# EAGLE design lighting_ctl_ft245_8 (EAGLE 5.01)
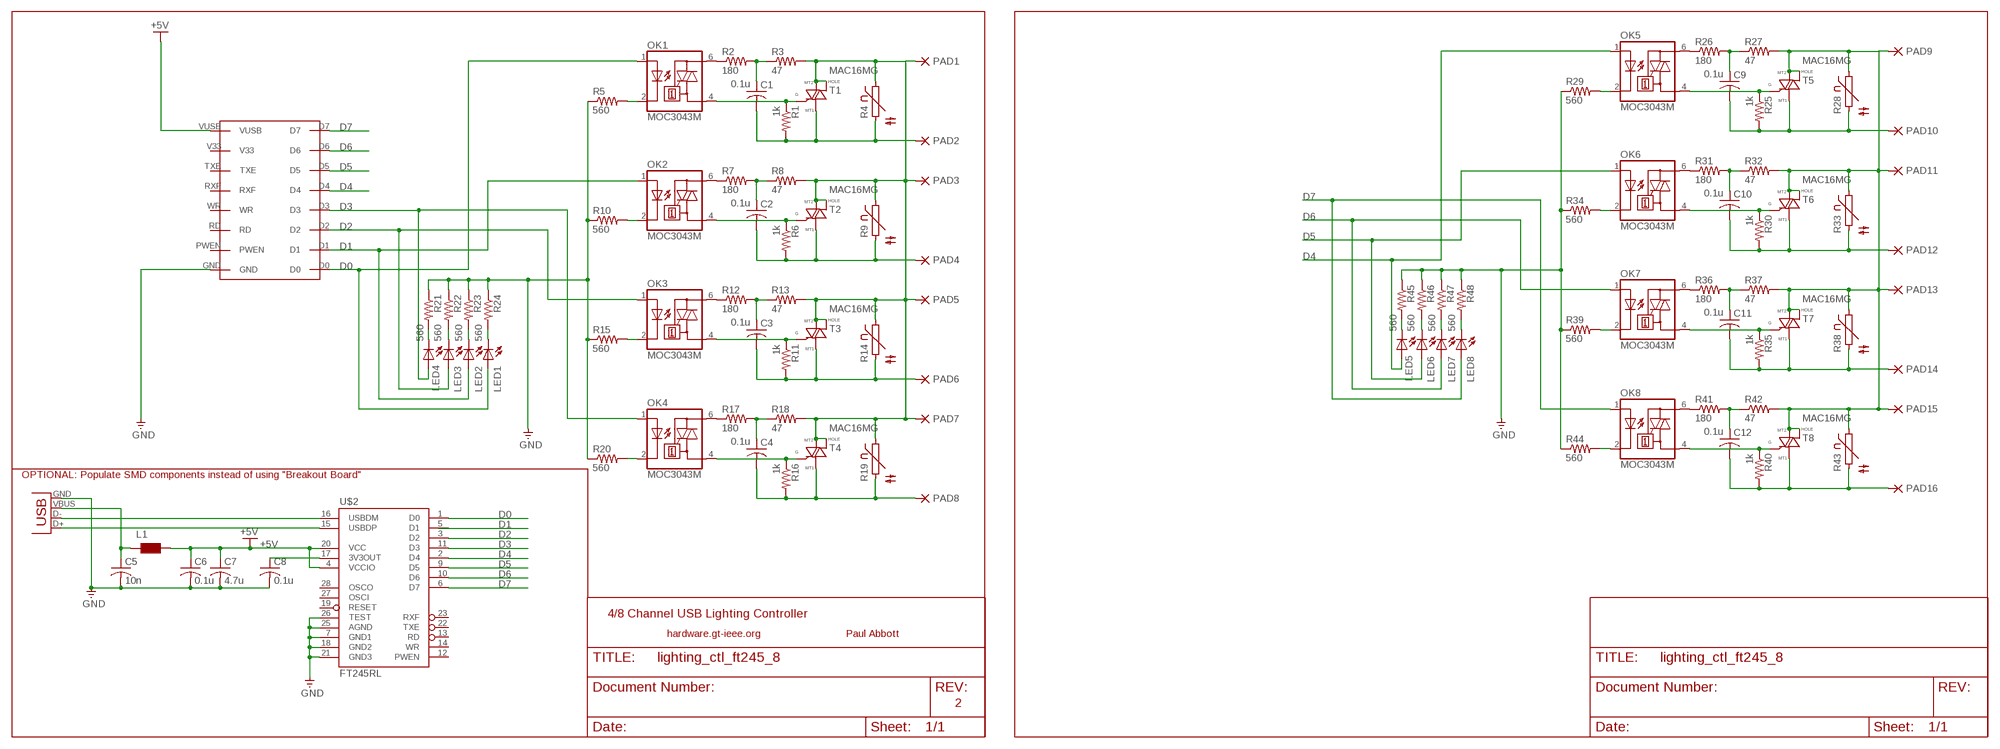
[diagram p0: schematic, sheet 1]

## Parts
C1  0.1u  C-US075-032X103  [C075-032X103]
C2  0.1u  C-US075-032X103  [C075-032X103]
C3  0.1u  C-US075-032X103  [C075-032X103]
C4  0.1u  C-US075-032X103  [C075-032X103]
C5  10n  C-USC0603  [C0603]
C6  0.1u  C-USC0603  [C0603]
C7  4.7u  C-USC1206  [C1206]
C8  0.1u  C-USC0603  [C0603]
C9  0.1u  C-US075-032X103  [C075-032X103]
C10  0.1u  C-US075-032X103  [C075-032X103]
C11  0.1u  C-US075-032X103  [C075-032X103]
C12  0.1u  C-US075-032X103  [C075-032X103]
L1  WE-CBF_0805  [0805]
LED1  LED3MM  [LED3MM]
LED2  LED3MM  [LED3MM]
LED3  LED3MM  [LED3MM]
LED4  LED3MM  [LED3MM]
LED5  LED3MM  [LED3MM]
LED6  LED3MM  [LED3MM]
LED7  LED3MM  [LED3MM]
LED8  LED3MM  [LED3MM]
OK1  MOC3043M  MOC3010M  [DIL06]
OK2  MOC3043M  MOC3010M  [DIL06]
OK3  MOC3043M  MOC3010M  [DIL06]
OK4  MOC3043M  MOC3010M  [DIL06]
OK5  MOC3043M  MOC3010M  [DIL06]
OK6  MOC3043M  MOC3010M  [DIL06]
OK7  MOC3043M  MOC3010M  [DIL06]
OK8  MOC3043M  MOC3010M  [DIL06]
PAD1  PAD-0820  [0820]
PAD2  PAD-0820  [0820]
PAD3  PAD-0820  [0820]
PAD4  PAD-0820  [0820]
PAD5  PAD-0820  [0820]
PAD6  PAD-0820  [0820]
PAD7  PAD-0820  [0820]
PAD8  PAD-0820  [0820]
PAD9  PAD-0820  [0820]
PAD10  PAD-0820  [0820]
PAD11  PAD-0820  [0820]
PAD12  PAD-0820  [0820]
PAD13  PAD-0820  [0820]
PAD14  PAD-0820  [0820]
PAD15  PAD-0820  [0820]
PAD16  PAD-0820  [0820]
R1  1k  R-US_0613/5V  [P0613V]
R2  180  R-US_0613/5V  [P0613V]
R3  47  R-US_0613/5V  [P0613V]
R4  P595  [P595]
R5  560  R-US_0613/5V  [P0613V]
R6  1k  R-US_0613/5V  [P0613V]
R7  180  R-US_0613/5V  [P0613V]
R8  47  R-US_0613/5V  [P0613V]
R9  P595  [P595]
R10  560  R-US_0613/5V  [P0613V]
R11  1k  R-US_0613/5V  [P0613V]
R12  180  R-US_0613/5V  [P0613V]
R13  47  R-US_0613/5V  [P0613V]
R14  P595  [P595]
R15  560  R-US_0613/5V  [P0613V]
R16  1k  R-US_0613/5V  [P0613V]
R17  180  R-US_0613/5V  [P0613V]
R18  47  R-US_0613/5V  [P0613V]
R19  P595  [P595]
R20  560  R-US_0613/5V  [P0613V]
R21  560  R-US_0613/5V  [P0613V]
R22  560  R-US_0613/5V  [P0613V]
R23  560  R-US_0613/5V  [P0613V]
R24  560  R-US_0613/5V  [P0613V]
R25  1k  R-US_0613/5V  [P0613V]
R26  180  R-US_0613/5V  [P0613V]
R27  47  R-US_0613/5V  [P0613V]
R28  P595  [P595]
R29  560  R-US_0613/5V  [P0613V]
R30  1k  R-US_0613/5V  [P0613V]
R31  180  R-US_0613/5V  [P0613V]
R32  47  R-US_0613/5V  [P0613V]
R33  P595  [P595]
R34  560  R-US_0613/5V  [P0613V]
R35  1k  R-US_0613/5V  [P0613V]
R36  180  R-US_0613/5V  [P0613V]
R37  47  R-US_0613/5V  [P0613V]
R38  P595  [P595]
R39  560  R-US_0613/5V  [P0613V]
R40  1k  R-US_0613/5V  [P0613V]
R41  180  R-US_0613/5V  [P0613V]
R42  47  R-US_0613/5V  [P0613V]
R43  P595  [P595]
R44  560  R-US_0613/5V  [P0613V]
R45  560  R-US_0613/5V  [P0613V]
R46  560  R-US_0613/5V  [P0613V]
R47  560  R-US_0613/5V  [P0613V]
R48  560  R-US_0613/5V  [P0613V]
T1  MAC16MG  BT138  [TO220BH]
T2  MAC16MG  BT138  [TO220BH]
T3  MAC16MG  BT138  [TO220BH]
T4  MAC16MG  BT138  [TO220BH]
T5  MAC16MG  BT138  [TO220BH]
T6  MAC16MG  BT138  [TO220BH]
T7  MAC16MG  BT138  [TO220BH]
T8  MAC16MG  BT138  [TO220BH]
U$1  FT245BREAKOUT  [FT245BREAKOUT]
U$2  FT245RL  [SSOP28DB]
X1  USBSMD  [USB-MINIB]

## Nets
+5V [5V]: C6.1 C7.1 L1.2 U$1.VUSB U$2.4(VCCIO) U$2.20(VCC)
D0 [data]: LED1.A OK1.1(A) U$1.D0 U$2.1(D0)
D1 [data]: LED2.A OK2.1(A) U$1.D1 U$2.5(D1)
D2 [data]: LED3.A OK3.1(A) U$1.D2 U$2.3(D2)
D3 [data]: LED4.A OK4.1(A) U$1.D3 U$2.11(D3)
D4 [data]: LED5.A OK5.1(A) U$1.D4 U$2.2(D4)
D5 [data]: LED6.A OK6.1(A) U$1.D5 U$2.9(D5)
D6 [data]: LED7.A OK7.1(A) U$1.D6 U$2.10(D6)
D7 [data]: LED8.A OK8.1(A) U$1.D7 U$2.6(D7)
GND [5V]: C5.2 C6.2 C7.2 C8.2 R5.1 R10.1 R15.1 R20.1 R21.1 R22.1 R23.1 R24.1 R29.1 R34.1 R39.1 R44.1 R45.1 R46.1 R47.1 R48.1 U$1.GND U$2.7(GND1) U$2.18(GND2) U$2.21(GND3) U$2.25(AGND) U$2.26(TEST) X1.GND
L1_COMM [power]: PAD1.P$1(P) PAD3.P$1(P) PAD5.P$1(P) PAD7.P$1(P) R3.2 R4.1 R8.2 R9.1 R13.2 R14.1 R18.2 R19.1 T1.HOLE T1.T2(A2) T2.HOLE T2.T2(A2) T3.HOLE T3.T2(A2) T4.HOLE T4.T2(A2)
L2_COMM [power]: PAD9.P$1(P) PAD11.P$1(P) PAD13.P$1(P) PAD15.P$1(P) R27.2 R28.1 R32.2 R33.1 R37.2 R38.1 R42.2 R43.1 T5.HOLE T5.T2(A2) T6.HOLE T6.T2(A2) T7.HOLE T7.T2(A2) T8.HOLE T8.T2(A2)
N$1 [power]: C1.2 PAD2.P$1(P) R1.2 R4.2 T1.T1(A1)
N$2: OK1.4(A1) R1.1 T1.G
N$3: OK1.6(A2) R2.1
N$4 [power]: C2.2 PAD4.P$1(P) R6.2 R9.2 T2.T1(A1)
N$5 [data]: U$2.15(USBDP) X1.D+
N$6: C1.1 R2.2 R3.1
N$7 [data]: U$2.16(USBDM) X1.D-
N$8: OK1.2(C) R5.2
N$9: OK2.4(A1) R6.1 T2.G
N$10: OK2.6(A2) R7.1
N$11: LED1.K(C) R24.2
N$12: C2.1 R7.2 R8.1
N$13: OK2.2(C) R10.2
N$14: LED2.K(C) R23.2
N$15 [power]: C3.2 PAD6.P$1(P) R11.2 R14.2 T3.T1(A1)
N$16: OK3.4(A1) R11.1 T3.G
N$17: OK3.6(A2) R12.1
N$18: C8.1 U$2.17(3V3OUT)
N$19: C3.1 R12.2 R13.1
N$20: OK3.2(C) R15.2
N$21 [power]: C4.2 PAD8.P$1(P) R16.2 R19.2 T4.T1(A1)
N$22: OK4.4(A1) R16.1 T4.G
N$23: OK4.6(A2) R17.1
N$24: LED3.K(C) R22.2
N$25: C4.1 R17.2 R18.1
N$26: OK4.2(C) R20.2
N$27: LED4.K(C) R21.2
N$28 [5V]: C5.1 L1.1 X1.VBUS
N$29 [power]: C9.2 PAD10.P$1(P) R25.2 R28.2 T5.T1(A1)
N$30: OK5.4(A1) R25.1 T5.G
N$31: OK5.6(A2) R26.1
N$32: C9.1 R26.2 R27.1
N$33 [power]: C10.2 PAD12.P$1(P) R30.2 R33.2 T6.T1(A1)
N$34: OK6.4(A1) R30.1 T6.G
N$35: OK6.6(A2) R31.1
N$36: C10.1 R31.2 R32.1
N$37 [power]: C11.2 PAD14.P$1(P) R35.2 R38.2 T7.T1(A1)
N$38: OK7.4(A1) R35.1 T7.G
N$39: OK7.6(A2) R36.1
N$40: C11.1 R36.2 R37.1
N$41 [power]: C12.2 PAD16.P$1(P) R40.2 R43.2 T8.T1(A1)
N$42: OK8.4(A1) R40.1 T8.G
N$43: OK8.6(A2) R41.1
N$44: C12.1 R41.2 R42.1
N$45: LED8.K(C) R48.2
N$46: LED7.K(C) R47.2
N$47: LED6.K(C) R46.2
N$48: LED5.K(C) R45.2
N$49: OK5.2(C) R29.2
N$50: OK6.2(C) R34.2
N$51: OK7.2(C) R39.2
N$52: OK8.2(C) R44.2
Unconnected: U$1.PWEN U$1.RD U$1.RXF U$1.TXE U$1.V33 U$1.WR U$2.12(PWEN) U$2.13(RD) U$2.14(WR) U$2.19(RESET) U$2.22(TXE) U$2.23(RXF) U$2.27(OSCI) U$2.28(OSCO)

## Notes on the sheet
- OPTIONAL: Populate SMD components instead of using "Breakout Board"
- 4/8 Channel USB Lighting Controller
- hardware.gt-ieee.org | Paul Abbott
- 2

## Library data of the parts
C1-C12 = rcl:C-US: CAPACITOR, American symbol
L1 = wuerth-elektronik:WE-CBF: SMD EMI Suppression Ferrite Beads - excellent anti-EMI properties - low DCR - impedances till 3000 ohms - rated current up to 6 A
LED1-LED8 = led:LED: LED OSRAM: - CHIPLED LG R971, LG N971, LY N971, LG Q971, LY Q971, LO R971, LY R971 LH N974, LH R974 LS Q976, LO Q976, LY Q976 LO Q996 - Hyper CHIPLED LW Q18S LB Q993, LB Q99A, LB R99A - SideLED LS A670, LO A670, LY A670, LG A670, LP A670 LB A673, LV A673, LT A673, LW A673 LH A674 LY A675 LS A676, LA A676, LO A676, LY A676, LW A676 LS A679, LY A679, LG A679 - Hyper Micro SIDELED® LS Y876, LA Y876, LO Y876, LY Y876 LT Y87S - SmartLED LW L88C, LW L88S LB L89C, LB L89S, LG L890 LS L89K, LO L89K, LY L89K LS L896, LA L896, LO L896, LY L896 - TOPLED LS T670, LO T670, LY T670, LG T670, LP T670 LSG T670, LSP T670, LSY T670, LOP T670, LYG T670 LG T671, LOG T671, LSG T671 LB T673, LV T673, LT T673, LW T673 LH T674 LS T676, LA T676, LO T676, LY T676, LB T676, LH T676, LSB T676, LW T676 LB T67C, LV T67C, LT T67C, LS T67K, LO T67K, LY T67K, LW E67C LS E67B, LA E67B, LO E67B, LY E67B, LB E67C, LV E67C, LT E67C LW T67C LS T679, LY T679, LG T679 LS T770, LO T770, LY T770, LG T770, LP T770 LB T773, LV T773, LT T773, LW T773 LH T774 LS E675, LA E675, LY E675, LS T675 LS T776, LA T776, LO T776, LY T776, LB T776 LHGB T686 LT T68C, LB T68C - Hyper Mini TOPLED® LB M676 - Mini TOPLED Santana® LG M470 LS M47K, LO M47K, LY M47K Source: http://www.osram.convergy.de - LUMILED® LXK2-PW12-R00, LXK2-PW12-S00, LXK2-PW14-U00, LXK2-PW14-V00 LXK2-PM12-R00, LXK2-PM12-S00, LXK2-PM14-U00 LXK2-PE12-Q00, LXK2-PE12-R00, LXK2-PE12-S00, LXK2-PE14-T00, LXK2-PE14-U00 LXK2-PB12-K00, LXK2-PB12-L00, LXK2-PB12-M00, LXK2-PB14-N00, LXK2-PB14-P00, LXK2-PB14-Q00 LXK2-PR12-L00, LXK2-PR12-M00, LXK2-PR14-Q00, LXK2-PR14-R00 LXK2-PD12-Q00, LXK2-PD12-R00, LXK2-PD12-S00 LXK2-PH12-R00, LXK2-PH12-S00 LXK2-PL12-P00, LXK2-PL12-Q00, LXK2-PL12-R00 Source: www.luxeon.com
OK1-OK8 = optocoupler:MOC30*M: RANDOM-PHASE OPTOISOLATORS TRIAC DRIVER OUTPUT Source: http://www.fairchildsemi.com MOC3020-M.pdf
PAD1-PAD16 = dpads:PAD: WIRE PAD Standard US Drill Sizes and SMD pads
R1-R3 R5-R8 R10-R13 R15-R18 R20-R27 R29-R32 R34-R37 R39-R42 R44-R48 = rcl:R-US_: RESISTOR, American symbol
R4 R9 R14 R19 R28 R33 R38 R43 = varistor:P595: VARISTOR
T1-T8 = GT-IEEE:BT138: TRIAC Source: http://www.semiconductors.philips.com BT138_SERIES_2.pdf
U$1 = lighting_ctl_ft245:FT245BREAKOUT
U$2 = lighting_ctl_ft245:FT245RL: USB FIFO Controller 4th Generation USB Controller (USB <-> Parallel) - FIFO. Spark Fun Electronics SKU : COM-00787
X1 = lighting_ctl_ft245:USB: USB Connectors USB-B-PTH is fully proven SKU : PRT-00139 USB-miniB is fully proven SKU : PRT-00587 USB-A-PCB is untested. USB-A-H is throughly reviewed, but untested. Spark Fun Electronics SKU : PRT-00437 USB-B-SMT is throughly reviewed, but untested. Needs silkscreen touching up. USB-A-S has not been used/tested USB-MB-H has not been used/tested

## Net classes
0 default: width 0.406 mm, drill 0.584 mm, clearance 0.406 mm
1 power: width 0.813 mm, drill 0.584 mm, clearance 0.61 mm
2 data: width 0.254 mm, drill 0.381 mm, clearance 0.254 mm
3 5V: width 0.305 mm, drill 0.584 mm, clearance 0.305 mm

## Board
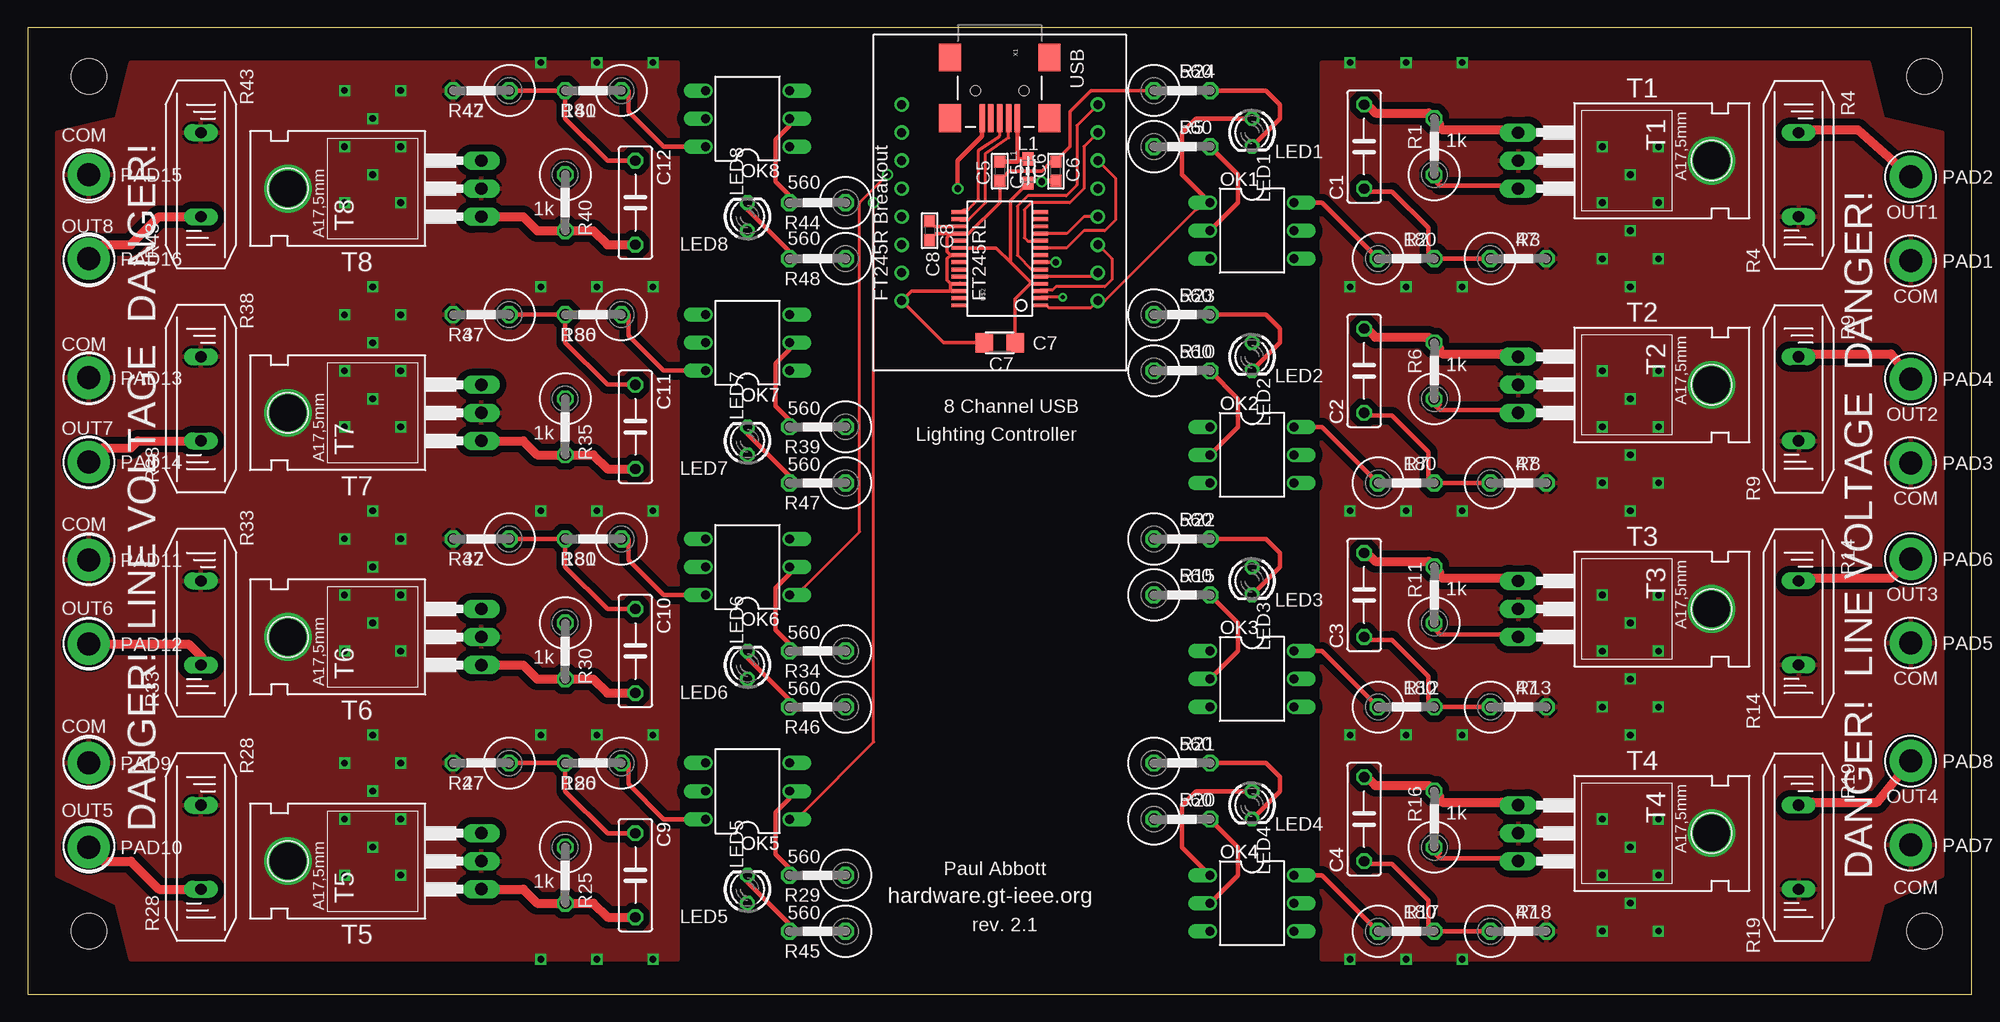
[diagram p1: board, top side]
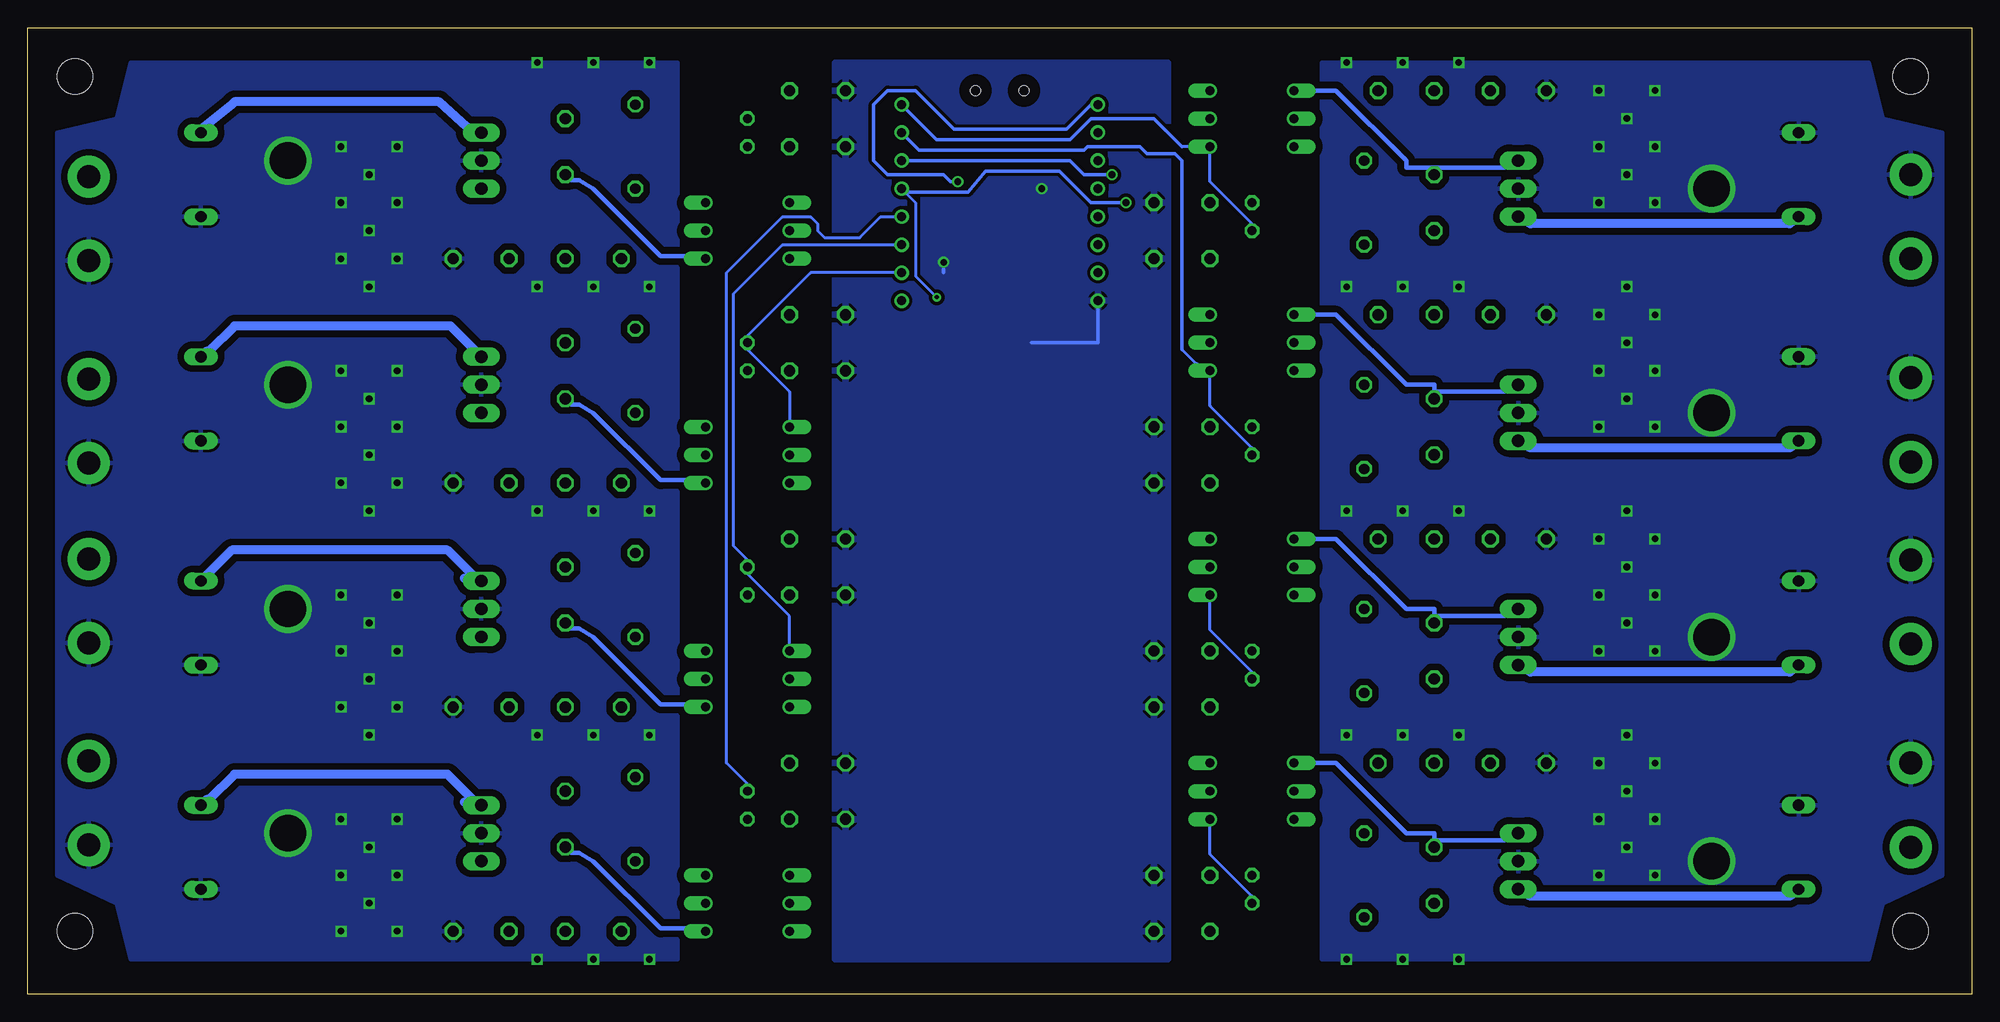
[diagram p2: board, bottom side, seen from below]

Size 176.2 x 87.62 mm. Coordinates in mm from the lower left corner, seen from the top.
Outline: 0,0 176.2,0 176.2,87.62 0,87.62 0,0
Copper layers (1*16): Top 0.035mm / dielectric 1.5mm / Bottom 0.035mm
Design rules "default": minimum track width 10mil, minimum drill 24mil, track to track 8mil, track to pad 8mil, pad to pad 8mil, via to via 8mil, smd to smd 8mil, copper to edge 40mil, drill to drill 8mil, minimum pad ring 10mil, minimum via ring 8mil, stop-mask expansion 4mil, vias tented up to drill 0mil, thermal gap 10mil
Holes 3.2 mm at 171.92,83.18 171.92,5.71 5.55,5.71 5.55,83.18

### Footprints (pad centres in the part's own frame; a part is rotated, then mirrored left to right if it is on the bottom)
C075-032X103 = drill 0.914 octagon: 1 -3.81,0; 2 3.81,0
C0603 = smd 1.1 x 1: 1 -0.85,0; 2 0.85,0
C1206 = smd 1.6 x 1.8: 1 -1.4,0; 2 1.4,0
0805 = smd 1.2 x 1: 1 -1.1,0; 2 1.1,0
LED3MM = drill 0.813 octagon: A -1.27,0; K 1.27,0
DIL06 = drill 0.813 offset: 1 -2.54,-3.81; 2 0,-3.81; 3 2.54,-3.81; 4 2.54,3.81; 5 0,3.81; 6 -2.54,3.81
0820 = drill 2.083 pad 3.81 round: P$1 0,0
P0613V = drill 1.016 octagon: 1 -2.54,0; 2 2.54,0
P595 = drill 1.016 long: 1 0,3.81; 2 0,-3.81
TO220BH = drill 1.118 long: G 2.54,-6.35; T1 -2.54,-6.35; T2 0,-6.35 | drill 3.302 round: HOLE 0,11.176
FT245BREAKOUT = drill 0.8 round: D0 -8.89,-8.89; D1 -6.35,-8.89; D2 -3.81,-8.89; D3 -1.27,-8.89; D4 1.27,-8.89; D5 3.81,-8.89; D6 6.35,-8.89; D7 8.89,-8.89; GND -8.89,8.89; PWEN -6.35,8.89; RD -3.81,8.89; RXF 1.27,8.89; TXE 3.81,8.89; V33 6.35,8.89; VUSB 8.89,8.89; WR -1.27,8.89
SSOP28DB = smd 0.348 x 1.397: 1 -4.225,-3.656; 2 -3.575,-3.656; 3 -2.925,-3.656; 4 -2.275,-3.656; 5 -1.625,-3.656; 6 -0.975,-3.656; 7 -0.325,-3.656; 8 0.325,-3.656; 9 0.975,-3.656; 10 1.625,-3.656; 11 2.275,-3.656; 12 2.925,-3.656; 13 3.575,-3.656; 14 4.225,-3.656; 15 4.225,3.656; 16 3.575,3.656; 17 2.925,3.656; 18 2.275,3.656; 19 1.625,3.656; 20 0.975,3.656; 21 0.325,3.656; 22 -0.325,3.656; 23 -0.975,3.656; 24 -1.625,3.656; 25 -2.275,3.656; 26 -2.925,3.656; 27 -3.575,3.656; 28 -4.225,3.656
USB-MINIB = smd 2.5 x 0.5: D+ 2.5,0; D- 2.5,0.8; GND 2.5,-1.6; ID 2.5,-0.8; VBUS 2.5,1.6 | smd 2.5 x 2: GND@1 -3,-4.5; GND@2 -3,4.5; GND@3 2.5,4.5; GND@4 2.5,-4.5 | hole 0.9: 0,2.2; 0,-2.2

### Placement (x,y rotation side)
C1  121.12,76.83 90 top
C2  121.12,56.51 90 top
C3  121.12,36.19 90 top
C4  121.12,15.87 90 top
C5  88.1,74.61 270 top
C6  93.18,74.61 90 top
C7  88.1,59.05 180 top
C8  81.75,69.21 270 top
C9  55.08,10.79 270 top
C10  55.08,31.11 270 top
C11  55.08,51.43 270 top
C12  55.08,71.75 270 top
L1  90.64,74.61 270 top
LED1  110.96,78.1 270 top
LED2  110.96,57.78 270 top
LED3  110.96,37.46 270 top
LED4  110.96,17.14 270 top
LED5  65.24,9.52 90 top
LED6  65.24,29.84 90 top
LED7  65.24,50.16 90 top
LED8  65.24,70.48 90 top
OK1  110.96,69.21 270 top
OK2  110.96,48.89 270 top
OK3  110.96,28.57 270 top
OK4  110.96,8.25 270 top
OK5  65.24,18.41 90 top
OK6  65.24,38.73 90 top
OK7  65.24,59.05 90 top
OK8  65.24,79.37 90 top
PAD1  170.65,66.48 0 top
PAD2  170.65,74.1 0 top
PAD3  170.65,48.16 0 top
PAD4  170.65,55.78 0 top
PAD5  170.65,31.84 0 top
PAD6  170.65,39.46 0 top
PAD7  170.65,13.52 0 top
PAD8  170.65,21.14 0 top
PAD9  5.55,20.95 0 top
PAD10  5.55,13.33 0 top
PAD11  5.55,39.36 0 top
PAD12  5.55,31.75 0 top
PAD13  5.55,55.88 0 top
PAD14  5.55,48.25 0 top
PAD15  5.55,74.29 0 top
PAD16  5.55,66.67 0 top
R1  127.47,76.83 90 top
R2  124.93,66.67 0 top
R3  135.09,66.67 0 top
R4  160.49,74.29 180 top
R5  104.61,76.83 0 top
R6  127.47,56.51 90 top
R7  124.93,46.35 0 top
R8  135.09,46.35 0 top
R9  160.49,53.97 180 top
R10  104.61,56.51 0 top
R11  127.47,36.19 90 top
R12  124.93,26.03 0 top
R13  135.09,26.03 0 top
R14  160.49,33.65 180 top
R15  104.61,36.19 0 top
R16  127.47,15.87 90 top
R17  124.93,5.71 0 top
R18  135.09,5.71 0 top
R19  160.49,13.33 180 top
R20  104.61,15.87 0 top
R21  104.61,20.95 0 top
R22  104.61,41.27 0 top
R23  104.61,61.59 0 top
R24  104.61,81.91 0 top
R25  48.73,10.79 270 top
R26  51.27,20.95 180 top
R27  41.11,20.95 180 top
R28  15.71,13.33 0 top
R29  71.59,10.79 180 top
R30  48.73,31.11 270 top
R31  51.27,41.27 180 top
R32  41.11,41.27 180 top
R33  15.71,33.65 0 top
R34  71.59,31.11 180 top
R35  48.73,51.43 270 top
R36  51.27,61.59 180 top
R37  41.11,61.59 180 top
R38  15.71,53.97 0 top
R39  71.59,51.43 180 top
R40  48.73,71.75 270 top
R41  51.27,81.91 180 top
R42  41.11,81.91 180 top
R43  15.71,74.29 0 top
R44  71.59,71.75 180 top
R45  71.59,5.71 180 top
R46  71.59,26.03 180 top
R47  71.59,46.35 180 top
R48  71.59,66.67 180 top
T1  141.44,75.56 270 top
T2  141.44,55.24 270 top
T3  141.44,34.92 270 top
T4  141.44,14.6 270 top
T5  34.76,12.06 90 top
T6  34.76,32.38 90 top
T7  34.76,52.7 90 top
T8  34.76,73.02 90 top
U$1  88.1,71.75 90 top
U$2  88.1,66.67 90 top
X1  88.1,81.91 270 top

### Tracks (layer width: path | path; a pad name or v marks a point on that pad's centre or on a via)
+5V  (via drill 0.6)
  Top 0.305: C7.1 89.5,62.99 90.9,64.4 U$2.4 91.01,64.4 89.05,66.35 | 89.05,66.35 89.05,71.92 L1.2 | U$2.20 87.76,67.65 89.05,66.35 | v91.91,73.66 93.08,73.66 C6.1
  Top 0.406: L1.2 90.64,73.76 C6.1
  Bottom 0.305: v91.91,73.66 92.54,73.66 93.18,74.29 98.26,74.29 99.53,75.56 99.53,80.64 98.26,81.91 95.72,81.91 92.23,78.42 82.07,78.42 79.84,80.64 U$1.VUSB
D0
  Top 0.254: U$2.1 92.32,62.45 92.54,62.22 96.35,62.22 U$1.D0 97.62,62.86 105.88,71.12 OK1.1
  Top 0.406: LED1.A 105.88,79.37 104.61,78.1 104.61,74.29 OK1.1
D1
  Top 0.254: U$1.D1 96.67,65.08 91.79,65.08
  Top 0.305: U$2.5 91.79,65.08
  Bottom 0.254: OK2.1 107.15,54.6 110.96,58.41 LED2.A 110.96,59.68 105.24,65.4 U$1.D1
D2
  Top 0.254: U$1.D2 98.26,66.67 98.26,64.77 97.62,64.13 93.18,64.13 92.86,63.81 91.82,63.81
  Top 0.305: 91.82,63.81 U$2.3
  Bottom 0.254: OK3.1 107.15,34.28 110.96,38.09 LED3.A 110.96,39.36 112.23,40.63 112.23,63.49 107.78,67.94 U$1.D2
D3
  Top 0.254: U$2.11 94.18,68.95 95.72,70.48 U$1.D3
  Top 0.406: OK4.1 104.61,13.33 104.61,17.14 105.88,18.41 LED4.A
  Bottom 0.254: U$1.D3 98.89,70.48 100.8,68.58 103.97,68.58 104.61,69.21 104.61,69.84 105.24,70.48 107.78,70.48 112.86,65.4 112.86,20.95 110.96,19.05 LED4.A
D4  (via drill 0.38, 0.61)
  Top 0.254: v93.81,63.18 91.84,63.18 U$2.2 | v76.67,71.75 76.67,22.86 70.32,16.51 OK5.1
  Bottom 0.254: U$1.D4 95.72,71.75 95.72,65.08 v93.81,63.18 | LED5.A 65.24,8.88 69.05,12.69 OK5.1
  Bottom 0.305: v76.67,71.75 79.84,71.75 82.7,74.61 89.37,74.61 90.96,72.7 96.67,72.7 U$1.D4
D5  (via drill 0.61)
  Top 0.254: U$2.9 94.15,67.65 95.72,69.21 97.62,69.21 98.58,70.16 98.58,73.97 U$1.D5 | v77.94,74.29 75.4,71.75 75.4,41.9 70.32,36.82 OK6.1
  Bottom 0.254: LED6.A 65.24,29.21 69.05,33.02 OK6.1
  Bottom 0.305: v77.94,74.29 80.48,74.29 81.75,75.56 U$1.D5
D6
  Top 0.254: U$1.D6 95.72,76.83 95.72,73.02 94.45,71.75 90.96,71.75 90.32,71.12 90.32,68.58 90.64,68.26 91.72,68.26
  Top 0.305: 91.72,68.26 U$2.10
  Bottom 0.254: LED7.A 65.24,49.52 69.05,53.34 OK7.1 70.32,57.14 71.59,58.41
  Bottom 0.305: U$1.D6 95.4,76.51 80.48,76.51 80.16,76.83 75.4,76.83 74.76,76.2 72.22,76.2 71.59,75.56 71.59,58.41
D7
  Top 0.254: U$1.D7 95.08,78.73 95.08,73.34 94.13,72.39 90.64,72.39 89.69,71.43 89.69,66.99 90.98,65.7 U$2.6
  Bottom 0.254: LED8.A 65.24,69.84 69.05,73.66 OK8.1 71.59,76.83
  Bottom 0.305: U$1.D7 93.81,77.47 81.75,77.47 79.84,79.37 74.13,79.37 71.59,76.83
GND  (via drill 0.6)
  Top 0.305: 84.5,68.89 85.24,68.89 88.1,71.75 C5.2 88.95,74.61 91.91,74.61 92.76,75.46 C6.2 93.18,75.56 94.45,76.83 94.45,80.01 96.35,81.91 R24.1 | 84.5,68.89 U$2.18 82.33,68.95 C8.2 | 84.5,64.45 U$2.25 83.65,64.4 | 83.65,63.74 80.09,63.74 U$1.GND 83.02,59.05 C7.2 | 83.65,63.74 U$2.26 | 83.65,63.74 83.65,64.4 | 84.5,68.89 83.65,68.89 83.34,68.58 83.34,67.31 83.65,66.99 U$2.21 83.66,67 83.34,66.67 83.34,64.71 83.65,64.4 | U$2.7 v93.17,66.34 v93.18,66.35
  Top 0.406: X1.GND 86.5,77.77 84.29,75.56 v84.29,73.02
  Bottom 0.305: 85.24,59.05 79.21,59.05 U$1.GND | 93.18,65.4 v93.18,66.35
  pour Bottom: 103.02,84.45 72.86,84.45 72.86,3.17 103.02,3.17
L1_COMM  (via drill 0.6)
  other vias: 119.85,64.13 124.93,64.13 119.85,84.45 124.93,84.45 130.01,84.45 142.71,76.83 147.79,76.83 145.25,74.29 142.71,71.75 147.79,71.75 142.71,66.67 147.79,66.67 145.25,64.13 130.01,64.13 119.85,43.81 124.93,43.81 130.01,43.81 119.85,23.49 124.93,23.49 130.01,23.49 119.85,3.17 124.93,3.17 130.01,3.17 142.71,56.51 147.79,56.51 145.25,53.97 142.71,51.43 147.79,51.43 145.25,48.89 142.71,46.35 147.79,46.35 145.25,43.81 142.71,36.19 145.25,69.21 147.79,36.19 145.25,33.65 145.25,28.57 147.79,31.11 142.71,31.11 142.71,26.03 147.79,26.03 145.25,23.49 145.25,13.33 147.79,15.87 142.71,15.87 142.71,10.79 147.79,10.79 145.25,8.25 147.79,5.71 142.71,5.71
  pour Bottom: 117.31,84.45 117.31,3.17 166.84,3.17 168.11,8.25 173.51,10.79 173.51,78.1 168.11,79.37 166.84,84.45
  pour Top: 117.31,84.45 117.31,3.17 166.84,3.17 168.11,8.25 173.51,10.79 173.51,78.1 168.11,79.37 166.84,84.45
L2_COMM  (via drill 0.6)
  other vias: 56.67,23.49 51.59,23.49 56.67,3.17 51.59,3.17 46.51,3.17 33.81,10.79 28.73,10.79 31.27,13.33 33.81,15.87 28.73,15.87 33.81,20.95 28.73,20.95 31.27,23.49 46.51,23.49 56.67,43.81 51.59,43.81 46.51,43.81 56.67,64.13 51.59,64.13 46.51,64.13 56.67,84.45 51.59,84.45 46.51,84.45 33.81,31.11 28.73,31.11 31.27,33.65 33.81,36.19 28.73,36.19 31.27,38.73 33.81,41.27 28.73,41.27 31.27,43.81 33.81,51.43 31.27,18.41 28.73,51.43 31.27,53.97 31.27,59.05 28.73,56.51 33.81,56.51 33.81,61.59 28.73,61.59 31.27,64.13 31.27,74.29 28.73,71.75 33.81,71.75 33.81,76.83 28.73,76.83 31.27,79.37 28.73,81.91 33.81,81.91
  pour Bottom: 58.89,84.45 58.89,3.17 9.36,3.17 8.09,8.25 2.69,10.79 2.69,78.1 8.09,79.37 9.36,84.45
  pour Top: 58.89,84.45 58.89,3.17 9.36,3.17 8.09,8.25 2.69,10.79 2.69,78.1 8.09,79.37 9.36,84.45
N$1
  Top 0.813: C1.2 121.63,80.39 122.14,79.88 126.96,79.88 R1.2 127.98,78.86 127.72,78.86 128.23,78.35 133.57,78.35 T1.T1 | R4.2 161.76,78.35 165.87,78.35 PAD2.P$1
  Bottom 0.813: T1.T1 136.36,78.61 138.9,80.89 157.44,80.89 157.7,80.64 160.24,78.61 R4.2
N$2
  Top 0.406: T1.G 133.57,73.27 127.98,73.27 127.47,73.78 127.98,73.78 R1.1
  Bottom 0.406: OK1.4 116.55,66.92 118.83,66.92 124.93,73.02 126.2,73.78 126.96,73.78 R1.1
N$3
  Top 0.406: OK1.6 117.31,71.75 R2.1
N$4
  Top 0.813: C2.2 121.63,60.07 122.14,59.56 126.96,59.56 R6.2 127.98,58.54 127.72,58.54 128.23,58.03 133.57,58.03 T2.T1 | R9.2 161.76,58.03 168.87,58.03 PAD4.P$1
  Bottom 0.813: T2.T1 137.88,60.57 157.44,60.57 159.73,58.29 159.98,58.29 R9.2
N$5
  Top 0.254: X1.D+ 88.1,77.78 86.19,76.51 86.19,72.07 85.24,71.12 84.86,71.12 U$2.15
N$6
  Top 0.406: C1.1 121.63,72.77 123.66,72.77 126.96,69.46 126.96,67.18 R2.2 R3.1
N$7
  Top 0.254: X1.D- 88.9,77.63 86.83,76.2 86.83,71.75 85.24,70.16 84.53,70.16 U$2.16
N$8
  Top 0.406: OK1.2 109.69,71.75 109.69,74.29 R5.2
N$9
  Top 0.406: T2.G 133.57,52.95 127.98,52.95 127.47,53.46 127.98,53.46 R6.1
  Bottom 0.406: OK2.4 116.55,46.6 118.83,46.6 124.93,52.7 126.2,53.46 126.96,53.46 R6.1
N$10
  Top 0.406: OK2.6 117.31,51.43 R7.1
N$11
  Top 0.406: R24.2 112.23,81.91 113.5,80.64 113.5,79.37 LED1.K
N$12
  Top 0.406: C2.1 121.63,52.45 123.66,52.45 126.96,49.14 126.96,46.86 R7.2 R8.1
N$13
  Top 0.406: OK2.2 109.69,51.43 109.69,53.97 R10.2
N$14
  Top 0.406: R23.2 112.23,61.59 113.5,60.32 113.5,59.05 LED2.K
N$15
  Top 0.813: C3.2 121.63,39.75 122.14,39.24 126.96,39.24 R11.2 127.98,38.22 127.72,38.22 128.23,37.71 133.57,37.71 T3.T1 | R14.2 161.76,37.71 168.87,37.71 PAD6.P$1
  Bottom 0.813: T3.T1 136.61,37.71 135.6,37.71 138.14,40.25 157.7,40.25 R14.2
N$16
  Top 0.406: T3.G 133.57,32.63 127.98,32.63 127.47,33.14 127.98,33.14 R11.1
  Bottom 0.406: OK3.4 116.55,26.28 118.83,26.28 124.93,32.38 126.2,33.14 126.96,33.14 R11.1
N$17
  Top 0.406: OK3.6 117.31,31.11 R12.1
N$18
  Top 0.305: U$2.17 82.21,69.59 C8.1
N$19
  Top 0.406: C3.1 121.63,32.13 123.66,32.13 126.96,28.82 126.96,26.54 R12.2 R13.1
N$20
  Top 0.406: R15.2 109.69,33.65 109.69,31.11 OK3.2
N$21
  Top 0.813: C4.2 121.63,19.43 122.14,18.92 126.96,18.92 R16.2 127.98,17.9 127.72,17.9 128.23,17.39 133.57,17.39 T4.T1 | R19.2 161.76,17.39 167.6,17.39 PAD8.P$1
  Bottom 0.813: T4.T1 136.61,17.39 135.6,17.39 138.14,19.93 157.44,19.93 159.73,17.65 159.98,17.65 R19.2
N$22
  Top 0.406: T4.G 133.57,12.31 127.98,12.31 127.47,12.82 127.98,12.82 R16.1
  Bottom 0.406: OK4.4 116.55,5.96 118.83,5.96 124.93,12.06 126.2,12.82 126.96,12.82 R16.1
N$23
  Top 0.406: OK4.6 117.31,10.79 R17.1
N$24
  Top 0.406: R22.2 112.23,41.27 113.5,40 113.5,38.73 LED3.K
N$25
  Top 0.406: C4.1 121.63,11.81 123.66,11.81 126.96,8.5 126.96,6.22 R17.2 R18.1
N$26
  Top 0.406: OK4.2 109.69,10.79 109.69,13.33 R20.2
N$27
  Top 0.406: LED4.K 113.5,18.41 113.5,19.68 112.23,20.95 R21.2
N$28
  Top 0.406: 89.7,75.71 X1.VBUS | 89.7,75.71 L1.1 | 89.7,75.71 89.7,75.46 C5.1
N$29
  Top 0.813: C9.2 52.54,6.98 51.27,8.25 R25.2 46.19,8.25 44.92,9.52 T5.T1 | R28.2 11.9,9.52 9.36,12.06 6.82,12.06 PAD10.P$1
  Bottom 0.813: T5.T1 40,8.88 16.5,8.88 R28.2
N$30
  Bottom 0.406: 48.73,13.96 48.73,14.6 51.27,14.6 57.62,20.95 OK5.4 | 48.73,13.96 42.38,13.96 T5.G | 48.73,13.96 R25.1
N$31
  Top 0.406: OK5.6 57.62,15.87 54.44,19.05 54.44,20.95 R26.1
N$32
  Top 0.406: C9.1 52.54,14.6 48.73,18.41 R26.2 R27.1
N$33
  Top 0.813: C10.2 52.54,27.3 51.27,28.57 R30.2 46.19,28.57 44.92,29.84 T6.T1 | PAD12.P$1 14.6,31.75 15.87,30.48 R33.2
  Bottom 0.813: T6.T1 40,29.21 16.5,29.21 R33.2
N$34
  Bottom 0.406: 48.73,34.28 48.73,34.92 51.27,34.92 57.62,41.27 OK6.4 | 48.73,34.28 42.38,34.28 T6.G | 48.73,34.28 R30.1
N$35
  Top 0.406: OK6.6 57.62,36.19 54.44,39.36 54.44,41.27 R31.1
N$36
  Top 0.406: C10.1 52.54,34.92 48.73,38.73 R31.2 R32.1
N$37
  Top 0.813: C11.2 52.54,47.62 51.27,48.89 R35.2 46.19,48.89 44.92,50.16 T7.T1 | R38.2 9.99,50.16 9.36,49.52 6.82,49.52 PAD14.P$1
  Bottom 0.813: T7.T1 40,49.52 16.5,49.52 R38.2
N$38
  Bottom 0.406: 48.73,54.6 48.73,55.24 51.27,55.24 57.62,61.59 OK7.4 | 48.73,54.6 42.38,54.6 T7.G | 48.73,54.6 R35.1
N$39
  Top 0.406: OK7.6 57.62,56.51 54.44,59.68 54.44,61.59 R36.1
N$40
  Top 0.406: C11.1 52.54,55.24 48.73,59.05 R36.2 R37.1
N$41
  Top 0.813: C12.2 52.54,67.94 51.27,69.21 R40.2 46.19,69.21 44.92,70.48 T8.T1 | R43.2 11.9,70.48 9.36,67.94 6.82,67.94 PAD16.P$1
  Bottom 0.813: T8.T1 40,69.84 16.5,69.84 R43.2
N$42
  Bottom 0.406: 48.73,74.93 51.27,74.93 51.27,75.56 57.62,81.91 OK8.4 | 48.73,74.93 42.38,74.93 T8.G | 48.73,74.93 R40.1
N$43
  Top 0.406: OK8.6 57.62,76.83 54.44,80.01 54.44,81.91 R41.1
N$44
  Top 0.406: C12.1 52.54,75.56 48.73,79.37 R41.2 R42.1
N$45
  Top 0.406: LED8.K 65.24,71.12 69.05,67.31 R48.2
N$46
  Top 0.406: LED7.K 65.24,50.79 69.05,46.98 R47.2
N$47
  Top 0.406: LED6.K 65.24,30.48 69.05,26.67 R46.2
N$48
  Top 0.406: LED5.K 65.24,10.15 69.05,6.34 R45.2
N$49
  Top 0.406: OK5.2 69.05,17.78 67.78,16.51 67.78,12.69 69.05,11.42 R29.2
N$50
  Top 0.406: OK6.2 69.05,38.09 67.78,36.82 67.78,33.02 69.05,31.75 R34.2
N$51
  Top 0.406: OK7.2 69.05,58.41 67.78,57.14 67.78,53.34 69.05,52.06 R39.2
N$52
  Top 0.406: OK8.2 69.05,78.73 67.78,77.47 67.78,73.66 69.05,72.39 R44.2

### Text on the board
_tsilk: USB | 560 | T1 | R43 | 47 | 180 | COM | 560 | 1k | DANGER! LINE VOLTAGE DANGER! | C12 | L1 | C6 | LED1 | OK8 | 560 | C5 | OK1 | 1k | C1 | OUT8 | OUT1 | LED8 | 560 | 180 | 47 | R4 | C8 | T8 | FT245RL | 560 | T2 | COM | COM | R38 | 47 | 180 | C7 | 560 | 1k | C11 | OK7 | LED2 | 560 | 8 Channel USB | OK2 | OUT7 | 1k | C2 | OUT2 | Lighting Controller | 560 | LED7 | 180 | 47 | R9 | T7 | COM | COM | 560 | T3 | R33 | 47 | 180 | 560 | 1k | OUT6 | C10 | OUT3 | OK6 | LED3 | 560 | OK3 | 1k | C3 | LED6 | 560 | COM | 180 | 47 | R14 | COM | T6 | 560 | T4 | R28 | 47 | 180 | OUT5 | 560 | 1k | OUT4 | C9 | LED4 | OK5 | 560 | OK4 | 1k | Paul Abbott | C4 | DANGER! LINE VOLTAGE DANGER! | COM | LED5 | 560 | hardware.gt-ieee.org | 180 | 47 | R19 | rev. 2.1 | T5
_tsilk2: R24 | R4 | T1 | A17,5mm | R5 | LED1 | R1 | OK1 | PAD2 | C1 | R2 | R3 | PAD1 | R23 | R9 | A17,5mm | T2 | R10 | R6 | LED2 | PAD4 | OK2 | C2 | R7 | R8 | PAD3 | R22 | R14 | A17,5mm | T3 | PAD6 | R15 | LED3 | R11 | OK3 | C3 | PAD5 | R12 | R13 | R21 | R19 | PAD8 | T4 | A17,5mm | R20 | LED4 | R16 | OK4 | PAD7 | C4 | R17 | R18